# EasyEDA Pro project P1.eprj, schematic Schematic1
Board Name: Schematic1; Create Date: 2025-03-07; Page Name: P1; Project Name: P1; Schematic Name: Schematic1; Update Date: 2025-04-09; Company: 嘉立创EDA; Page Size: A4; Version: V1.0
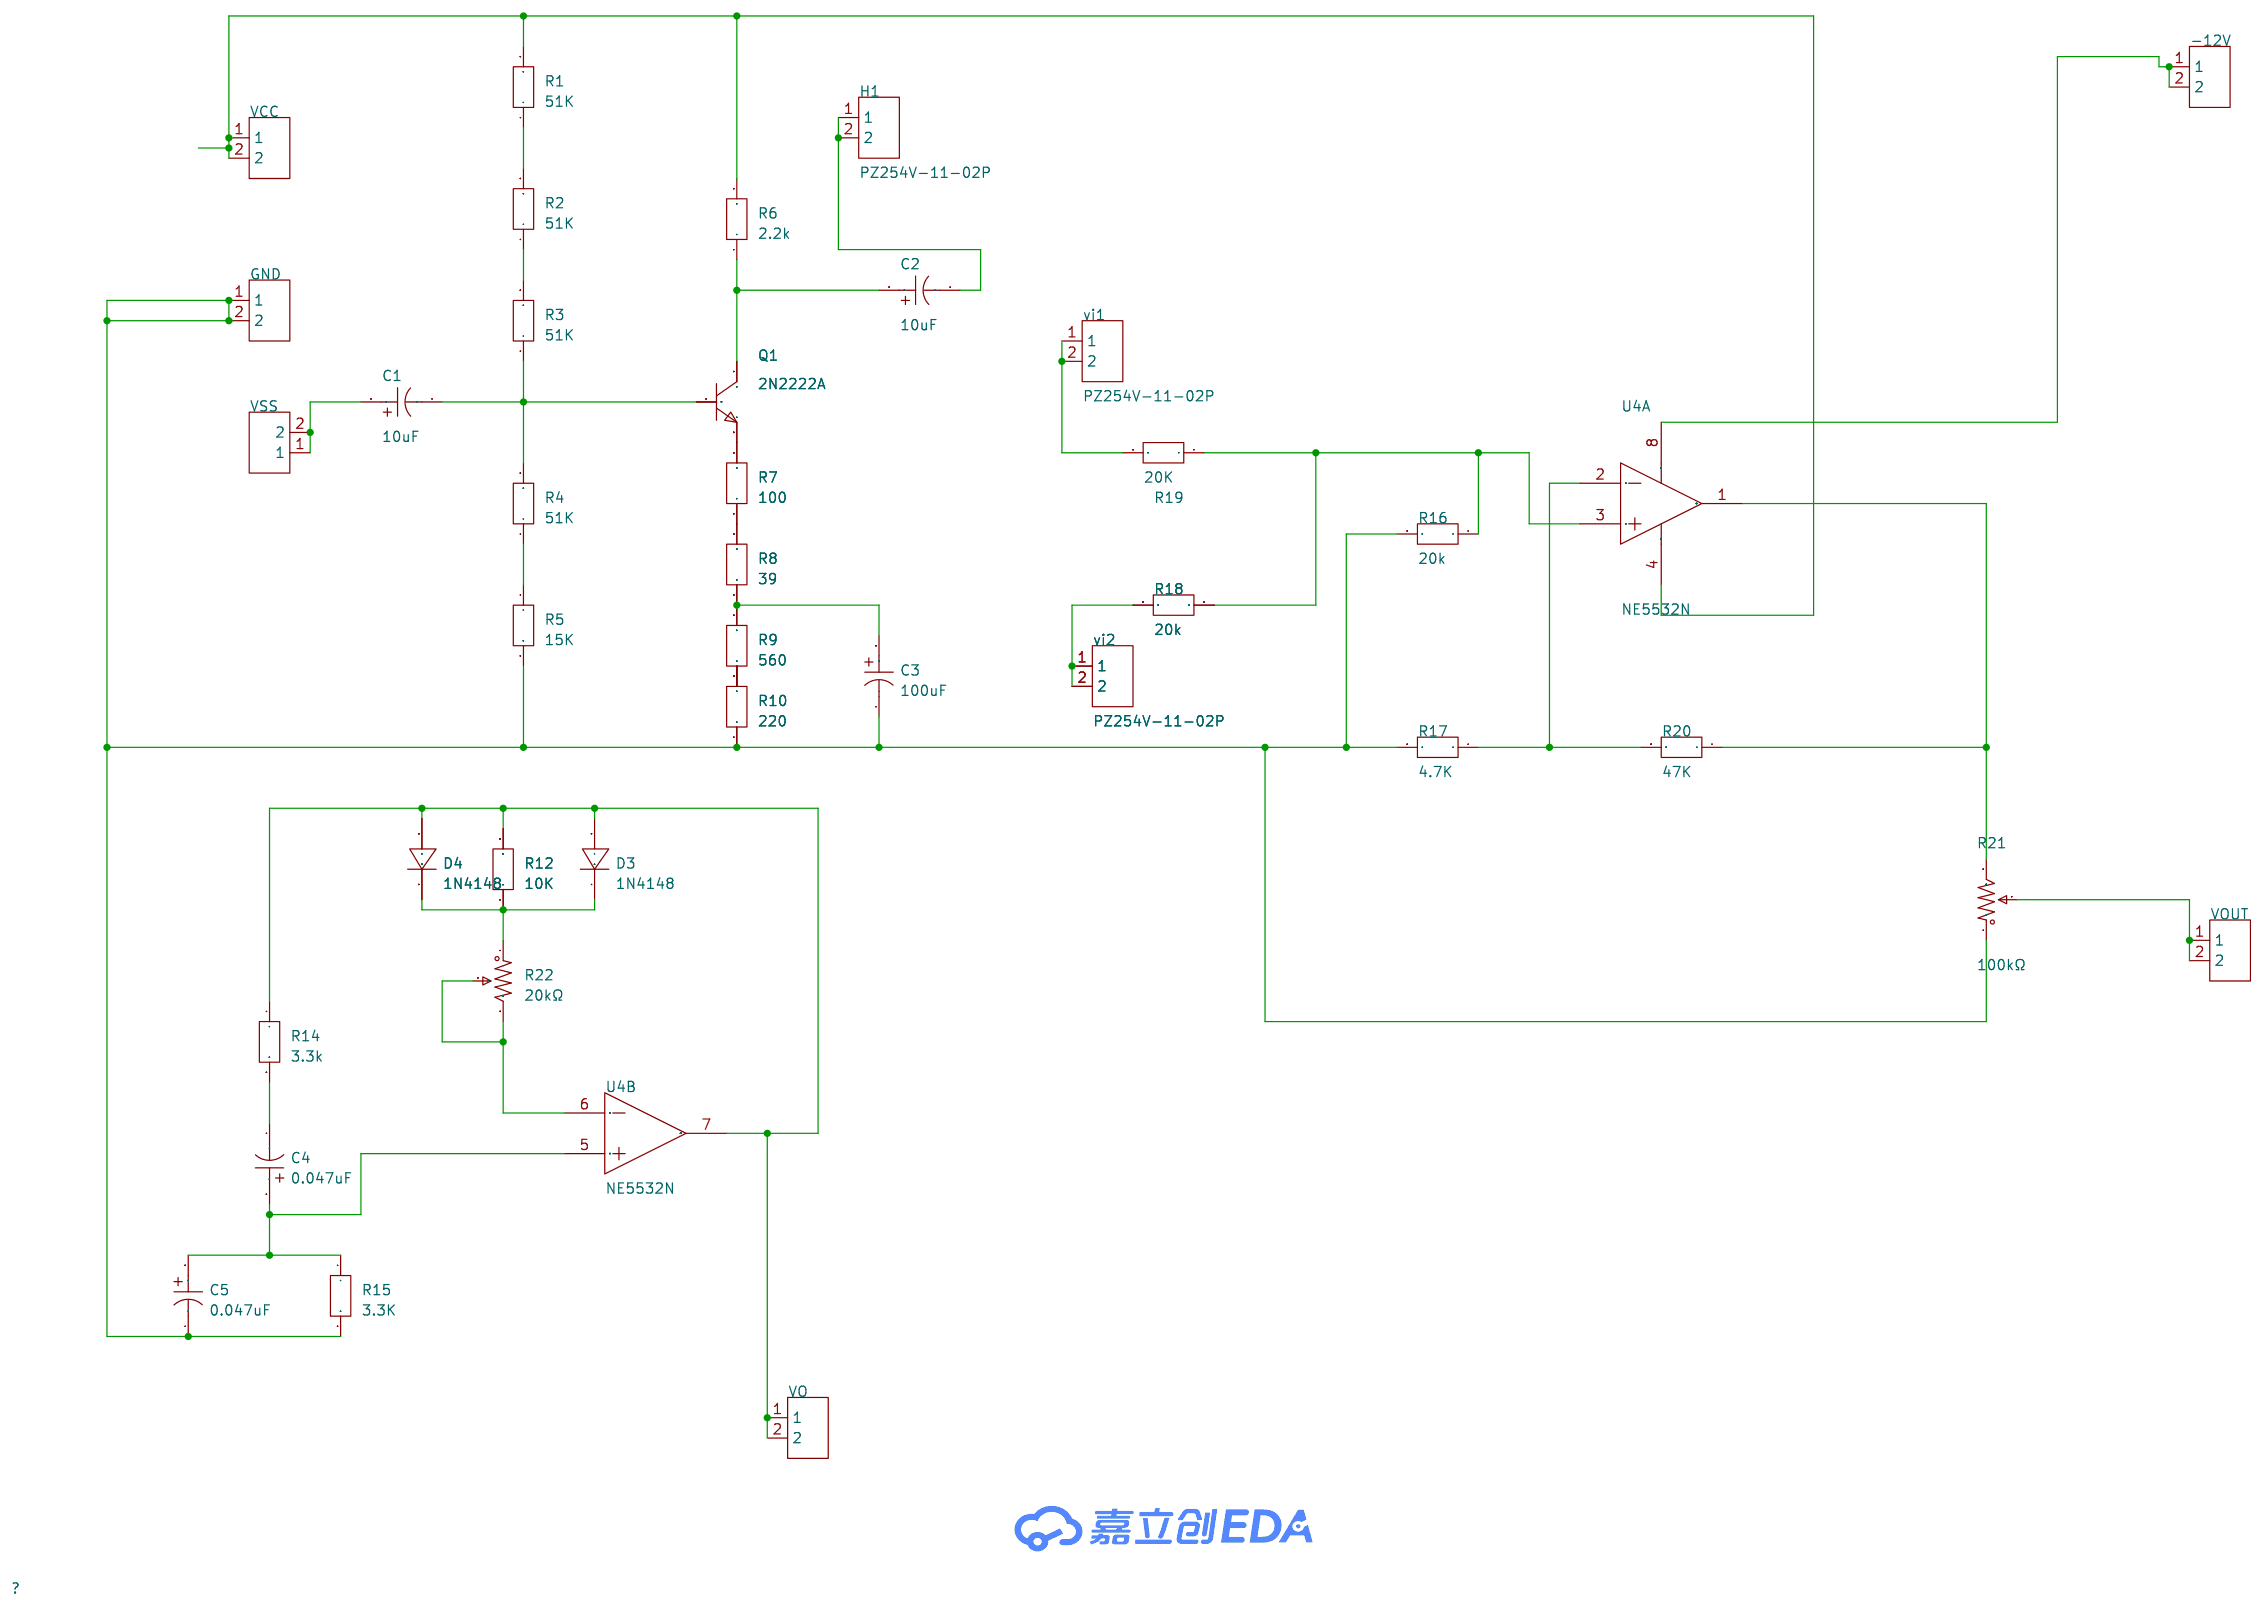
[diagram p2: schematic sheet]

## Parts
-12V  PZ254V-11-02P  [HDR-TH_2P-P2.54-V-M]
C1  10uF  [CAP-TH_BD5.5-P2.54-D0.5-FD]
C2  10uF  [CAP-TH_BD5.5-P2.54-D0.5-FD]
C3  100uF  [CAP-TH_BD5.5-P2.54-D0.5-FD]
C4  0.047uF  [CAP-TH_BD5.5-P2.54-D0.5-FD]
C5  0.047uF  [CAP-TH_BD5.5-P2.54-D0.5-FD]
D3  1N4148  [DO-35_BD2.0-L4.2-P8.20-D0.5-RD]
D4  1N4148  [DO-35_BD2.0-L4.2-P8.20-D0.5-RD]
GND  PZ254V-11-02P  [HDR-TH_2P-P2.54-V-M]
H1  PZ254V-11-02P  [HDR-TH_2P-P2.54-V-M]
Q1  2N2222A  [TO-92-3_L4.8-W3.7-P2.54-R]
R1  51K  [RES-TH_BD2.7-L6.2-P10.20-D0.4]
R2  51K  [RES-TH_BD2.7-L6.2-P10.20-D0.4]
R3  51K  [RES-TH_BD2.7-L6.2-P10.20-D0.4]
R4  51K  [RES-TH_BD2.7-L6.2-P10.20-D0.4]
R5  15K  [RES-TH_BD2.7-L6.2-P10.20-D0.4]
R6  2.2k  [RES-TH_BD2.7-L6.2-P10.20-D0.4]
R7  100  [RES-TH_BD2.7-L6.2-P10.20-D0.4]
R8  39  [RES-TH_BD2.7-L6.2-P10.20-D0.4]
R9  560  [RES-TH_BD2.7-L6.2-P10.20-D0.4]
R10  220  [RES-TH_BD2.7-L6.2-P10.20-D0.4]
R12  10K  [RES-TH_BD2.7-L6.2-P10.20-D0.4]
R14  3.3k  [RES-TH_BD2.7-L6.2-P10.20-D0.4]
R15  3.3K  [RES-TH_BD2.7-L6.2-P10.20-D0.4]
R16  20k  [RES-TH_BD2.7-L6.2-P10.20-D0.4]
R17  4.7K  [RES-TH_BD2.7-L6.2-P10.20-D0.4]
R18  20k  [RES-TH_BD2.7-L6.2-P10.20-D0.4]
R19  20K  [RES-TH_BD2.7-L6.2-P10.20-D0.4]
R20  47K  [RES-TH_BD2.7-L6.2-P10.20-D0.4]
R21  100kΩ  [RES-ADJ-TH_3P-L10.0-W10.0-P2.50-L]
R22  20kΩ  [RES-ADJ-TH_3P-L10.0-W10.0-P2.50-L]
U4  NE5532N  [DIP-8_L9.3-W6.4-P2.54-LS7.6-BL]  (sections 1,2)
VCC  PZ254V-11-02P  [HDR-TH_2P-P2.54-V-M]
vi1  PZ254V-11-02P  [HDR-TH_2P-P2.54-V-M]
vi2  PZ254V-11-02P  [HDR-TH_2P-P2.54-V-M]
VO  PZ254V-11-02P  [HDR-TH_2P-P2.54-V-M]
VOUT  PZ254V-11-02P  [HDR-TH_2P-P2.54-V-M]
VSS  PZ254V-11-02P  [HDR-TH_2P-P2.54-V-M]

## Library data of the parts
-12V GND H1 VCC vi1 vi2 VO VOUT VSS = PZ254V-11-02P: LCSC Part Name: 1x2P 间距:2.54mm 方针 直插; Supplier Part: C492401; Manufacturer: XFCN(兴飞); Supplier Footprint: 插件,P=2.54mm; JLCPCB Part Class: 扩展库; Datasheet: https://atta.szlcsc.com/upload/public/pdf/source/20200309/C492401_A812433581A9B211A7FFA413ADDFF0E5.pdf; Supplier: LCSC; Pin Structure: 1x2P; Pitch: 2.54mm; Circluar Pins/Square Pins: 方针; Mounting Type: 直插; Number of Rows: 单排; Number of Pins: 2P; Length of Mating Pin: 6mm; Insulation Height: 2.5mm; Length of End Connection Pin: 3mm; Contact Material: 黄铜; Operating Temperature: -40℃~+105℃; Color: 黑色
C1-C5 = 199D106X0025C1V1E3: LCSC Part Name: 10uF ±20% 25V; Supplier Part: C1651807; Manufacturer: VISHAY(威世); Supplier Footprint: 插件; JLCPCB Part Class: 扩展库; Datasheet: https://atta.szlcsc.com/upload/public/pdf/source/20210702/CD5661637E1895F7F44D1BD24DD66A39.pdf; Supplier: LCSC; Tolerance: ±20%; Rated Voltage: 25V; Operating Temperature: -55℃~+125℃
D3 D4 = 1N4148_C402212: Supplier Part: C402212; Manufacturer: LGE(鲁光); Supplier Footprint: DO-35; JLCPCB Part Class: 扩展库; Datasheet: https://atta.szlcsc.com/upload/public/pdf/source/20190705/C402212_D6CD0A8EA8714742E0940C7C02C37BFA.pdf; Supplier: LCSC; Voltage - Forward(Vf@If): 1V@10mA; Voltage - DC Reverse(Vr): 75V; Current - Rectified: 150mA; Reverse Leakage Current (Ir): 5uA@75V; Reverse Recovery Time (trr): 4ns
Q1 = 2N2222A_C358533: LCSC Part Name: NPN 电流:600mA 耐压:40V (100-300); Supplier Part: C358533; Manufacturer: BLUE ROCKET(蓝箭); Supplier Footprint: TO-92-3; JLCPCB Part Class: 扩展库; Datasheet: https://atta.szlcsc.com/upload/public/pdf/source/20190129/C358533_AFAFE39542E316DF9E781A186BBE98F7.pdf; Supplier: LCSC; Transistor Type: NPN; Collector Current (Ic): 600mA; Collector-Emitter Breakdown Voltage (Vceo): 40V; Power Dissipation (Pd): 625mW; DC Current Gain (hFE@Ic,Vce): 100@150mA,10V; Transition Frequency (fT): 300MHz; Collector Cut-Off Current (Icbo): 100nA; Collector-Emitter Saturation Voltage (VCE(sat)@Ic,Ib): 600mV@500mA,50mA
R1-R10 R12 R14-R20 = MF1/4W-1K±1%-ST52: LCSC Part Name: 金属膜电阻 1kΩ ±1% 250mW; Supplier Part: C2903245; Manufacturer: VO(翔胜); Supplier Footprint: 插件,D2.7xL6.2mm; JLCPCB Part Class: 扩展库; Datasheet: https://atta.szlcsc.com/upload/public/pdf/source/20200609/C601728_5AA4C0C8E12E11069DA2C3356F29D1F2.pdf; Supplier: LCSC; Type: 金属膜电阻; Tolerance: ±1%; Overload Voltage (Max): 250V; Power(Watts): 250mW; Temperature Coefficient: ±100ppm/℃; Operating Temperature Range: -55℃~+155℃
R21 R22 = 3296W-1-103: LCSC Part Name: 10kΩ ±10%; Supplier Part: C118954; Manufacturer: BOCHEN(博晨); Supplier Footprint: 插件; JLCPCB Part Class: 扩展库; Datasheet: https://atta.szlcsc.com/upload/public/pdf/source/20171114/C118954_15106326646611117443.pdf; Supplier: LCSC; Tolerance: ±10%
U4 = NE5532N: Supplier Part: C2987282; Manufacturer: HGSEMI(华冠); Supplier Footprint: DIP-8; JLCPCB Part Class: 扩展库; Datasheet: https://atta.szlcsc.com/upload/public/pdf/source/20220420/2D3D2D023E04B50C3DA859F976397601.pdf; Supplier: LCSC; Number of Channels: 双路; Maximum Power Supply Range (Vdd-Vss): 44V; Gain Bandwidth Product: 10MHz; Vos - Input Offset Voltage: 5mV; Slew Rate: 11V/us; Ib - Input Bias Current: 500nA; Input Offset Current(Ios): 200nA; Noise density(eN): 8nV/√Hz@1kHz; Common Mode Rejection Ratio(CMRR): 100dB; Operating Temperature: 0℃~+70℃; Dual Supply: ±22V

## Nets
$1N487: R1.1 R2.2
$1N500: R2.1 R3.2
$1N505: C1.1 Q1.2(B) R3.1 R4.2
$1N510: R4.1 R5.1
$1N539: C1.2 VSS.1 VSS.2
$1N1031: C2.2 Q1.1(C) R6.1
$1N1035: Q1.3(E) R7.2
$1N1037: R7.1 R8.2
$1N1039: C3.2 R8.1 R9.2
$1N1078: R9.1 R10.2
$1N5445: C3.1 C5.1 GND.1 GND.2 R5.2 R10.1 R15.2 R16.2 R17.2 R21.1
$1N5507: C4.1 R14.2
$1N5529: D3.1(C) D4.1(C) R12.1 R22.1
$1N5558: R22.2 R22.3 U4.6(IN2-)
$1N5603: C4.2 C5.2 R15.1 U4.5(IN2+)
$1N5613: R1.2 R6.2 U4.4(VCC-) VCC.1 VCC.2
$1N5755: -12V.1 -12V.2 U4.8(VCC+)
$1N6867: R16.1 R18.1 R19.1 U4.3(IN1+)
$1N6870: R17.1 R20.2 U4.2(IN1-)
$1N6998: R20.1 R21.3 U4.1(OUT1)
$1N7213: R21.2 VOUT.1 VOUT.2
$1N8407: D3.2(A) D4.2(A) R12.2 R14.1 U4.7(OUT2) VO.1 VO.2
$1N8414: R19.2 vi1.1 vi1.2
$1N8423: C2.1 H1.1 H1.2
$1N8565: R18.2 vi2.1 vi2.2
